# Altium schematic sheet TX.SchDoc: {Наименование}
size 420 x 297 mm; DocumentNumber: ПЛАС.ХХХХХХ.ХХХ ХХ; SheetNumber: {}; SheetTotal: {}; PageSetup: Record=PageOptions|CenterHorizontal=False|CenterVertical=False|PrintScale=0.95|XCorrection=0.00|YCorrection=0.00|PrintKind=1|BorderSize=5000000|LeftOffset=0|BottomOffset=0|Orientation=1|PaperLength=1000|PaperWidth=1000|Scale=100|PaperSource=15|PrintQuality=600|MediaType=1|DitherType=10|PaperKind=A4|PrintScaleMode=1; Rule: PcbType=ProtelPcb
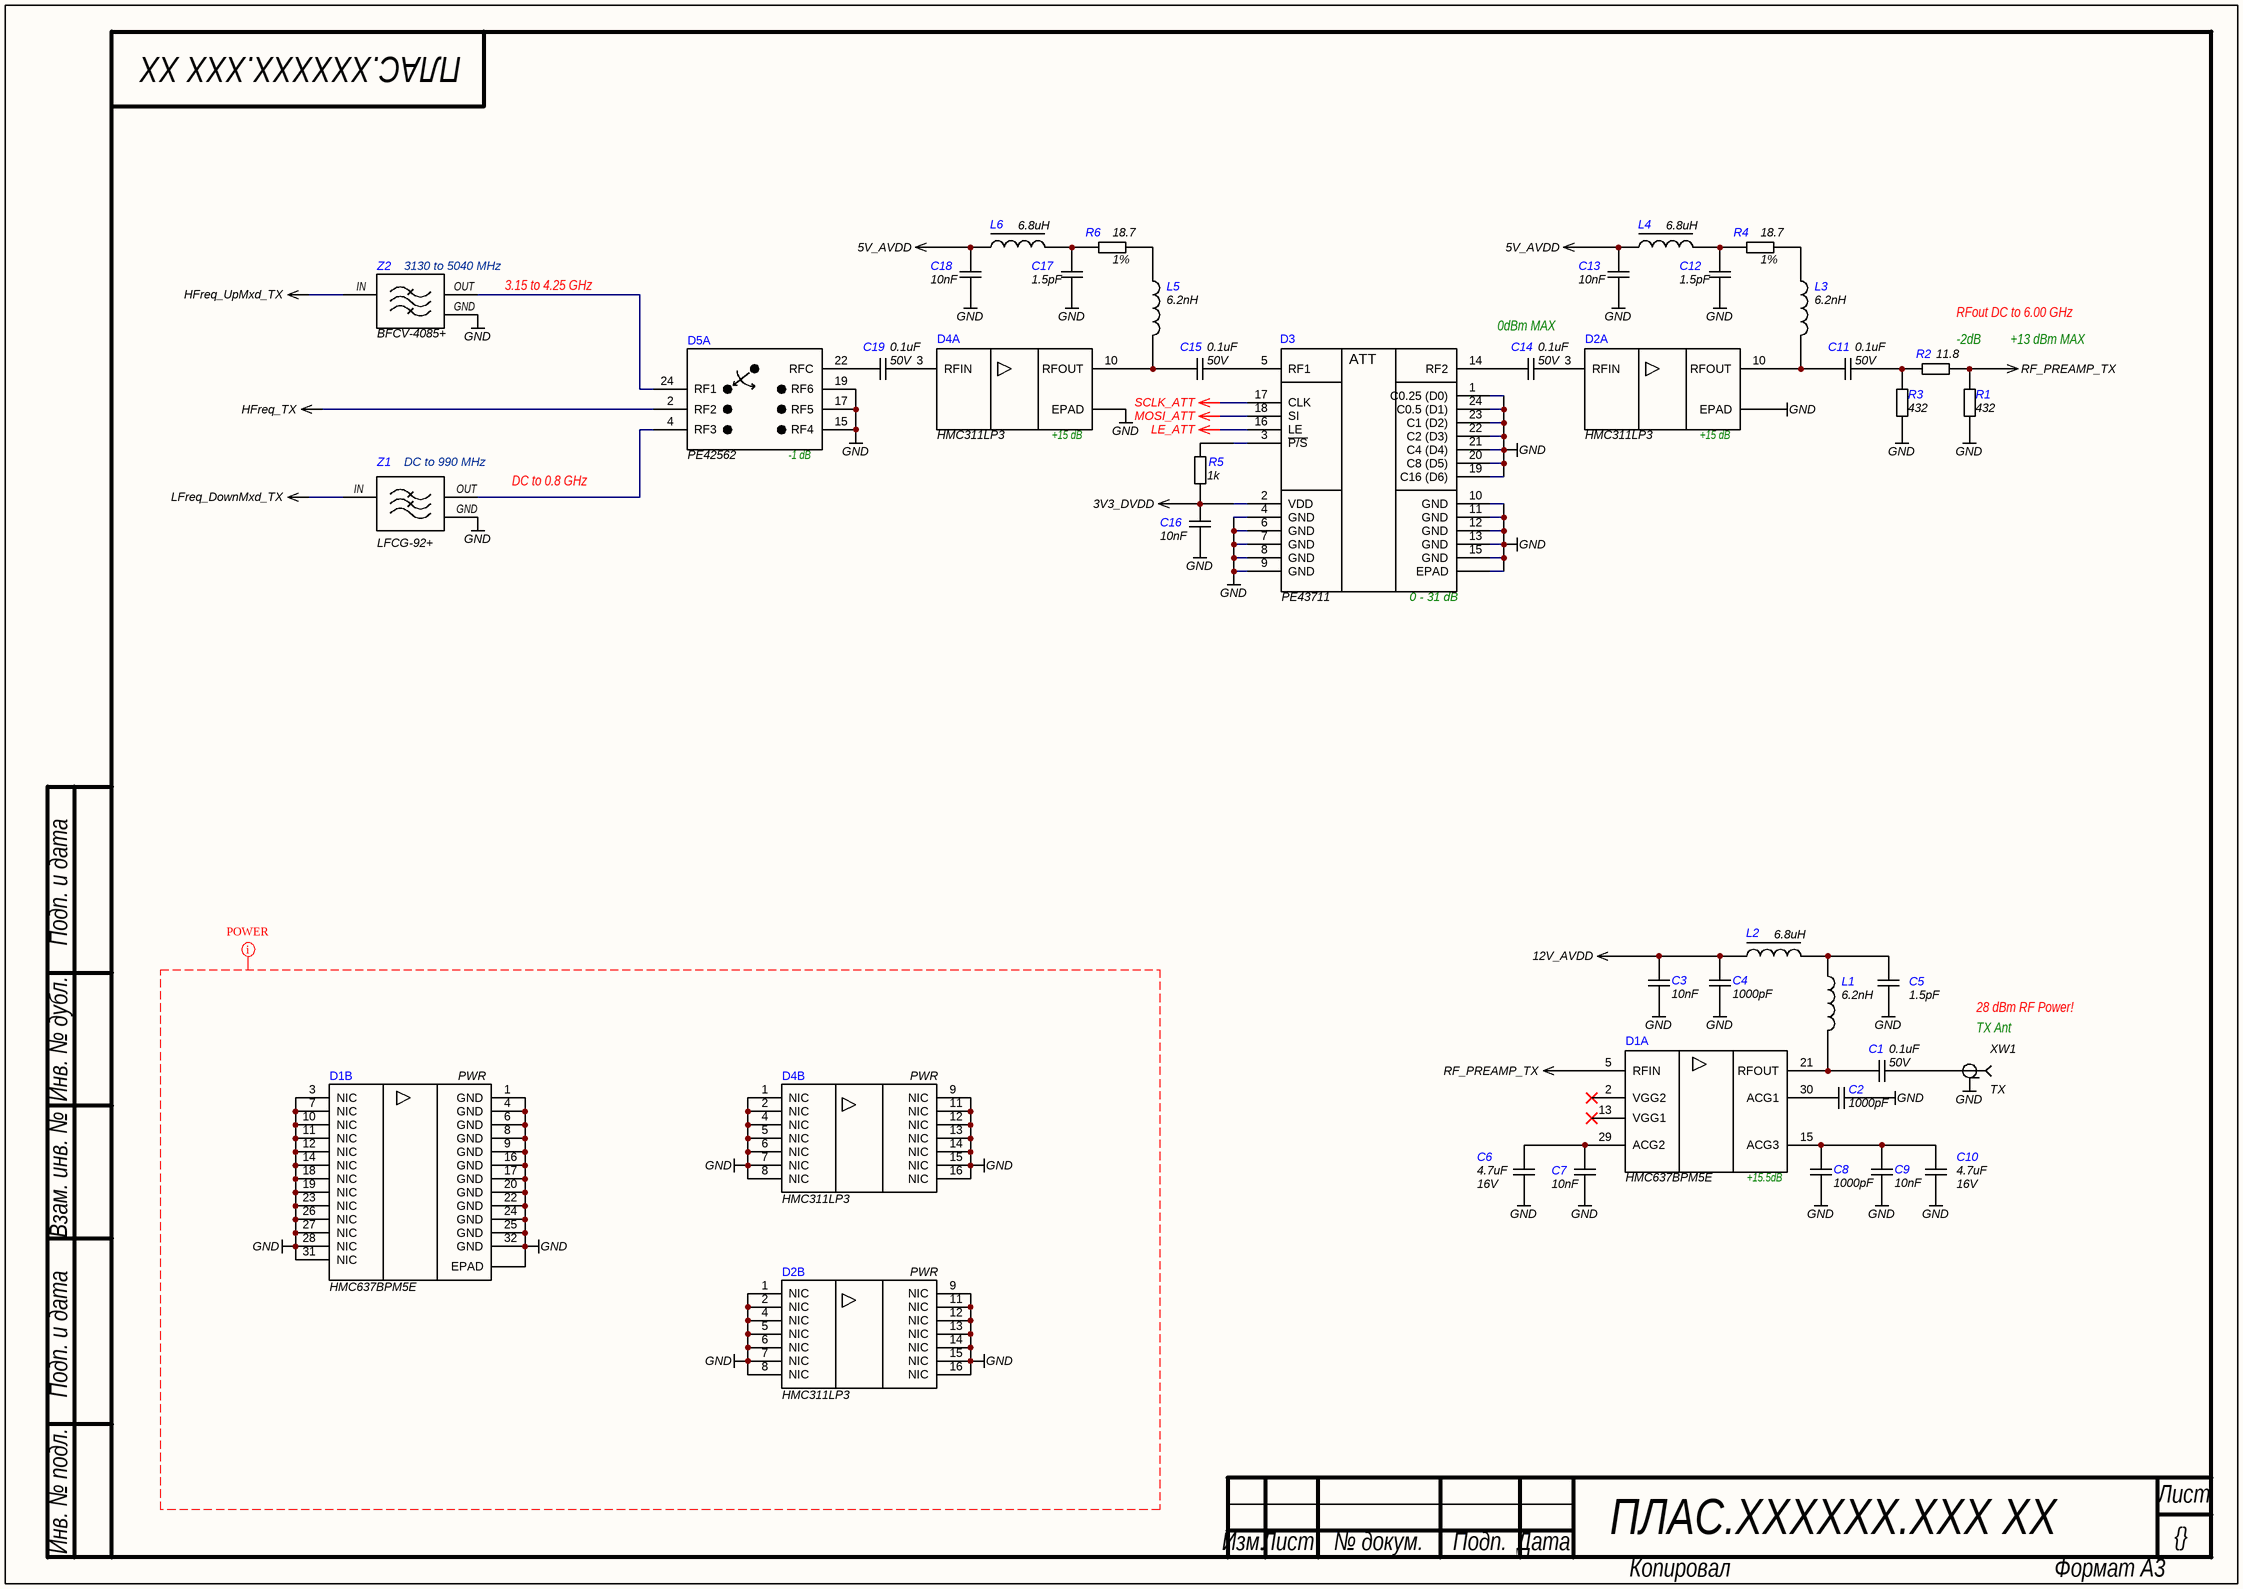
[diagram p0: TX.SchDoc]

## Parts
C1  value 0.1uF  Voltage: 50V  [C1206]  (hidden comment: CAP)
C2  value 1000pF  [C0402]  (hidden comment: CAP)
C3  value 10nF  [C0402]  (hidden comment: CAP)
C4  value 1000pF  [C0402]  (hidden comment: CAP)
C5  value 1.5pF  [C0402]  (hidden comment: CAP)
C6  value 4.7uF  Voltage: 16V  [C0603]  (hidden comment: CAP)
C7  value 10nF  [C0402]  (hidden comment: CAP)
C8  value 1000pF  [C0402]  (hidden comment: CAP)
C9  value 10nF  [C0402]  (hidden comment: CAP)
C10  value 4.7uF  Voltage: 16V  [C0603]  (hidden comment: CAP)
C11  value 0.1uF  Voltage: 50V  [C1206]  (hidden comment: CAP)
C12  value 1.5pF  [C0402]  (hidden comment: CAP)
C13  value 10nF  [C0402]  (hidden comment: CAP)
C14  value 0.1uF  Voltage: 50V  [C1206]  (hidden comment: CAP)
C15  value 0.1uF  Voltage: 50V  [C1206]  (hidden comment: CAP)
C16  value 10nF  [C0402]  (hidden comment: CAP)
C17  value 1.5pF  [C0402]  (hidden comment: CAP)
C18  value 10nF  [C0402]  (hidden comment: CAP)
C19  value 0.1uF  Voltage: 50V  [C1206]  (hidden comment: CAP)
D1  HMC637BPM5E  [LFCSP-32]  (parts A,B of 2)
D2  HMC311LP3  [QFN-16 v2]  (parts A,B of 2)
D3  PE43711  [QFN-24]
D4  HMC311LP3  [QFN-16 v2]  (parts A,B of 2)
D5  PE42562  [QFN-24]  (part A of 2)
L1  value 6.2nH  [L0805_HP]  (hidden comment: Inductor RF)
L2  value 6.8uH  [XFL3012]  (hidden comment: Inductor)
L3  value 6.2nH  [L0805_HP]  (hidden comment: Inductor RF)
L4  value 6.8uH  [XFL3012]  (hidden comment: Inductor)
L5  value 6.2nH  [L0805_HP]  (hidden comment: Inductor RF)
L6  value 6.8uH  [XFL3012]  (hidden comment: Inductor)
R1  value 432  [R0402]  (hidden comment: RES)
R2  value 11.8  [R0402]  (hidden comment: RES)
R3  value 432  [R0402]  (hidden comment: RES)
R4  value 18.7  Tolerance: 1%  [R0805]  (hidden comment: RES)
R5  value 1k  [R0402]  (hidden comment: RES)
R6  value 18.7  Tolerance: 1%  [R0805]  (hidden comment: RES)
XW1  TX  [MOLEX SD-73251-135 (Gold)]
Z1  LFCG-92+  Frequency: DC to 990 MHz  [GE0805C-2]
Z2  BFCV-4085+  Frequency: 3130 to 5040 MHz  [JV1210C]

## Nets
3V3_DVDD: C16.2 D3.2(VDD) R5.1
5V_AVDD: C13.2 C18.2 L4.1 L6.1
12V_AVDD: C3.2 C4.2 L2.1
GND: C2.2 C3.1 C4.1 C5.1 C6.2 C7.1 C8.1 C9.1 C10.2 C12.1 C13.1 C16.1 C17.1 C18.1 D1.0(EPAD) D1.1(GND) D1.3(NIC) D1.4(GND) D1.6(GND) D1.7(NIC) D1.8(GND) D1.9(GND) D1.10(NIC) D1.11(NIC) D1.12(NIC) D1.14(NIC) D1.16(GND) D1.17(GND) D1.18(NIC) D1.19(NIC) D1.20(GND) D1.22(GND) D1.23(NIC) D1.24(GND) D1.25(GND) D1.26(NIC) D1.27(NIC) D1.28(NIC) D1.31(NIC) D1.32(GND) D2.1(NIC) D2.2(NIC) D2.4(NIC) D2.5(NIC) D2.6(NIC) D2.7(NIC) D2.8(NIC) D2.9(NIC) D2.11(NIC) D2.12(NIC) D2.13(NIC) D2.14(NIC) D2.15(NIC) D2.16(NIC) D2.17(EPAD) D3.1(C0.25_(D0)) D3.4(GND) D3.6(GND) D3.7(GND) D3.8(GND) D3.9(GND) D3.10(GND) D3.11(GND) D3.12(GND) D3.13(GND) D3.15(GND) D3.19(C16_(D6)) D3.20(C8_(D5)) D3.21(C4_(D4)) D3.22(C2_(D3)) D3.23(C1_(D2)) D3.24(C0.5_(D1)) D3.25(EPAD) D4.1(NIC) D4.2(NIC) D4.4(NIC) D4.5(NIC) D4.6(NIC) D4.7(NIC) D4.8(NIC) D4.9(NIC) D4.11(NIC) D4.12(NIC) D4.13(NIC) D4.14(NIC) D4.15(NIC) D4.16(NIC) D4.17(EPAD) D5.15(RF4) D5.17(RF5) D5.19(RF6) R1.2 R3.2 XW1.G(GND) Z1.GND Z2.GND
HFreq_TX: D5.2(RF2)
HFreq_UpMxd_TX: Z2.IN
LE_ATT: D3.16(LE)
LFreq_DownMxd_TX: Z1.IN
MOSI_ATT: D3.18(SI)
RF_PREAMP_TX: D1.5(RFIN) R1.1 R2.1
SCLK_ATT: D3.17(CLK)
NetC1_1: C1.1 XW1.S(RF)
NetC1_2: C1.2 D1.21(RFOUT) L1.1
NetC2_1: C2.1 D1.30(ACG1)
NetC5_2: C5.2 L1.2 L2.2
NetC6_1: C6.1 C7.2 D1.29(ACG2)
NetC8_2: C8.2 C9.2 C10.1 D1.15(ACG3)
NetC11_1: C11.1 R2.2 R3.1
NetC11_2: C11.2 D2.10(RFOUT) L3.1
NetC12_2: C12.2 L4.2 R4.2
NetC14_1: C14.1 D2.3(RFIN)
NetC14_2: C14.2 D3.14(RF2)
NetC15_1: C15.1 D3.5(RF1)
NetC15_2: C15.2 D4.10(RFOUT) L5.1
NetC17_2: C17.2 L6.2 R6.2
NetC19_1: C19.1 D4.3(RFIN)
NetC19_2: C19.2 D5.22(RFC)
NetD3_3: D3.3(~{P/S}) R5.2
NetD5_4: D5.4(RF3) Z1.OUT
NetD5_24: D5.24(RF1) Z2.OUT
NetL3_2: L3.2 R4.1
NetL5_2: L5.2 R6.1

Not connected (* = marked no-connect by the designer): D1 2(VGG2)* 13(VGG1)*

## Layout directives
net class POWER: GND

## Notes on the sheet
- 3.15 to 4.25 GHz
- RFout DC to 6.00 GHz
- 0dBm MAX
- (near R2) -2dB
- +13 dBm MAX
- DC to 0.8 GHz
- (near XW1) TX Ant
- 28 dBm RF Power!
- Подп. и дата
- Инв. № дубл.
- Взам. инв. №
- Инв. № подл.
- Лист
- Изм.
- № докум.
- Подп.
- Дата
- Копировал
- Формат А3
- (in symbol HMC311LP3, part A) +15 dB
- (in symbol HMC311LP3, part B) PWR
- (in symbol HMC637BPM5E, part A) +15.5dB
- (in symbol HMC637BPM5E, part B) PWR
- (in symbol PE42562, part A) -1 dB
- (in symbol PE43711) ATT; 0 - 31 dB

## Library data of the parts
C1 C11 C14 C15 C19 = CAP: SMD Capacitor; Manufacturer: Murata; Material: NP0; Tolerance: 5%; Type: Ceramic Capacitor; P/N: GRM31C5C1H104JA01K; Supplier 1: Digi-key; Supplier Part Number 1: 490-8335-1-ND; Supplier 2: Mouser; Supplier Part Number 2: 81-GRM31C5C1H104JA1K; Supplier 3: Farnell; Supplier Part Number 3: *
C2 C4 C8 = CAP: SMD Capacitor; Manufacturer: Murata; Material: NP0; Tolerance: 5%; Voltage: 50V; Type: Ceramic Capacitor; P/N: GRM1555C1H102JA01D; Supplier 1: Digi-key; Supplier Part Number 1: 490-3244-1-ND; Supplier 2: Mouser; Supplier Part Number 2: 81-GRM1555C1H102JA1D; Supplier 3: Farnell; Supplier Part Number 3: *
C3 C7 C9 C13 C16 C18 = CAP: SMD Capacitor; Manufacturer: Murata; Material: X7R; Tolerance: 10%; Voltage: 25V; Type: Ceramic Capacitor; P/N: GRM155R71E103KA01D; Supplier 1: Digi-key; Supplier Part Number 1: 490-1312-1-ND; Supplier 2: Mouser; Supplier Part Number 2: 81-GRM36X103K25; Supplier 3: Farnell; Supplier Part Number 3: *
C5 C12 C17 = CAP: SMD Capacitor; Manufacturer: Murata; Material: NP0; Tolerance: ±0.05pF; Voltage: 50V; Type: Ceramic Capacitor; P/N: GRM1555C1H1R5WA01D; Supplier 1: Digi-key; Supplier Part Number 1: 490-6213-1-ND; Supplier 2: Mouser; Supplier Part Number 2: 81-GRM1555C1H1R5WA1D; Supplier 3: Farnell; Supplier Part Number 3: *
C6 C10 = CAP: SMD Capacitor; Manufacturer: Samsung; Material: X5R; Tolerance: 10%; Type: Ceramic Capacitor; P/N: CL10A475KO8NNNC; Supplier 1: Digi-key; Supplier Part Number 1: 1276-1784-1-ND; Supplier 2: Mouser; Supplier Part Number 2: 187-CL10A475KO8NNNC; Supplier 3: Farnell; Supplier Part Number 3: 3013397
D1 = HMC637BPM5E: 1 W Power Amplifier; Manufacturer: Analog Devices; Voltage: 12 V at 345 mA typical; Package: 32-lead, 5 mm × 5 mm LFCSP; Temperature Range: -40°C ~ 105°C; Type: Power Amplifier; P/N: HMC637BPM5E; Name: HMC637BPM5E; Supplier 1: Digi-key; Supplier Part Number 1: 505-HMC637BPM5E-ND; Supplier 2: Mouser; Supplier Part Number 2: 584-HMC637BPM5E; Supplier 3: Farnell; Supplier Part Number 3: *
D2 D4 = HMC311LP3: InGaP HBT GAIN BLOCK; Manufacturer: Analog Devices; P/N: HMC311LP3E; Name: HMC311LP3; Package: 16 Lead 3x3mm SMT; Type: GAIN BLOCK; Supplier 1: Digi-key; Supplier Part Number 1: 1127-2929-ND; Supplier 2: Mouser; Supplier Part Number 2: 584-HMC311LP3E; Supplier 3: Farnell; Supplier Part Number 3: *
D3 = PE43711: The PE43711 is a 50Ω, HaRP™ technology-enhanced, 7-bit RF digital step attenuator; Manufacturer: Peregrine Technical Solutions; P/N: PE43711A-Z; Type: 7-bit RF digital step attenuator (DSA); Name: PE43711; Package: 24-lead 4 × 4 × 0.85 mm QFN; Supplier 1: Digi-Key; Supplier Part Number 1: 1046-1138-1-ND; Supplier 2: Mouser; Supplier Part Number 2: 81-PE43711B-Z; Supplier 3: Farnell; Supplier Part Number 3: *
D5 = PE42562: The PE42582 is a HaRP™ technology-enhanced absorptive SP6T RF switch; Manufacturer: Peregrine Technical Solutions; P/N: PE42562A-X; Name: PE42562; Package: 24-lead 4 × 4 × 0.85 mm QFN; Type: Absorptive SP6T RF switch; Supplier 1: Digi-key; Supplier Part Number 1: *; Supplier 2: Mouser; Supplier Part Number 2: 81-PE42562A-X; Supplier 3: Farnell; Supplier Part Number 3: *
L1 L3 L5 = Inductor RF: Chip SMD Inductor; Manufacturer: Coilcraft; Current: 1.5A; Frequency: 7200MHz; Name: 0805HP-6N2XJR; Tolerance: 5%; Series: 0805HP; Temperature Range: -25…85°C; P/N: 0805HP-6N2XJR; Supplier 1: Digi-key; Supplier Part Number 1: *; Supplier 2: Mouser; Supplier Part Number 2: 994-0805HP-6N2XJRC; Supplier 3: Farnell; Supplier Part Number 3: 0805HP-6N2XJRB
L2 L4 L6 = Inductor: Chip SMD Inductor; Manufacturer: Coilcraft; Current: 0.61A; Frequency: 39.9MHz; Name: XFL3012-682ME; Tolerance: ±5%; Series: XFL3012; Temperature Range: -25…85°C; P/N: XFL3012-682ME; Supplier 1: Digi-key; Supplier Part Number 1: 2457-XFL3012-682MEC-ND; Supplier 2: Mouser; Supplier Part Number 2: 994-XFL3012-682MEC; Supplier 3: Farnell; Supplier Part Number 3: *
R1 R3 = RES: SMD Resistor; Manufacturer: Panasonic Electronic Components; Name: Chip SMD Resistor; Power: 0.1 Wt; Tolerance: ±1%; P/N: ERJ-2RKF4320X; Temperature Range: -55…155°C; Supplier 1: Digi-key; Supplier Part Number 1: P432LCT-ND; Supplier 2: Mouser; Supplier Part Number 2: 667-ERJ-2RKF4320X; Supplier 3: Farnell; Supplier Part Number 3: *
R2 = RES: SMD Resistor; Manufacturer: Vishay; Name: Chip SMD Resistor; Power: 0.063 Wt; Tolerance: ±1%; P/N: CRCW040211R8FKED; Temperature Range: -55…155°C; Supplier 1: Digi-key; Supplier Part Number 1: 541-11.8LCT-ND; Supplier 2: Mouser; Supplier Part Number 2: 71-CRCW040211R8FKED; Supplier 3: Farnell; Supplier Part Number 3: *
R4 R6 = RES: SMD Resistor; Manufacturer: Panasonic Electronic Components; Name: Chip SMD Resistor; Power: 0.125 Wt; P/N: ERJ-6ENF18R7V; Temperature Range: -55…155°C; Supplier 1: Digi-key; Supplier Part Number 1: P18.7CCT-ND; Supplier 2: Mouser; Supplier Part Number 2: 667-ERJ-6ENF18R7V; Supplier 3: Farnell; Supplier Part Number 3: *
R5 = RES: SMD Resistor; Name: Chip SMD Resistor; Power: 0.062 Wt; Tolerance: 5%; P/N: ERJ-2GEJ102X; Temperature Range: -55…155°C; Supplier 1: Digi-key; Supplier Part Number 1: P1.0KJCT-ND; Supplier 2: Mouser; Supplier Part Number 2: 667-ERJ-2GEJ102X; Supplier 3: Farnell; Supplier Part Number 3: *
XW1 = RF Connector: 50 Ohms, SMA Jack, Vertica; Manufacturer: Molex; Impedance: 50Ω; P/N: 0732511352; Name: SMA Jack; Type: 50 Ohms, SMA Jack, Vertical, PCB SMT, Gold (Au) Body; Supplier 1: Digi-Key; Supplier Part Number 1: WM9458-ND; Supplier 2: Mouser; Supplier Part Number 2: 538-73251-1352; Supplier 3: Farnell; Supplier Part Number 3: *
Z1 = LFCG-92+: Low Pass Filter; Manufacturer: Mini-Circuits; Name: LFCG-92+; P/N: LFCG-92+; Type: Low Pass Filter; Package: GE0805C-2; Supplier 1: Digi-key; Supplier Part Number 1: 3157-LFCG-92+CT-ND; Supplier 2: Mouser; Supplier Part Number 2: 139-LFCG-92; Supplier 3: Farnell; Supplier Part Number 3: *
Z2 = BFCV-4085+: Bandpass Filter; Manufacturer: Mini-Circuits; Name: BFCV-4085+; P/N: BFCV-4085+; Type: Bandpass Filter; Package: JV1210C; Supplier 1: Digi-key; Supplier Part Number 1: 3157-BFCV-4085+CT-ND; Supplier 2: Mouser; Supplier Part Number 2: 139-BFCV-4085; Supplier 3: Farnell; Supplier Part Number 3: *